# EAGLE schematic Linear Regulator (EAGLE 7.1.0)
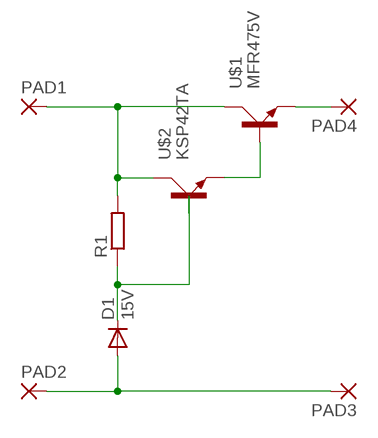
[diagram p0: schematic, sheet 1]

## Parts
D1  15V  DIODE-SOD80C  [SOD80C]
PAD1  2,54/0,9  [2,54/0,9]
PAD2  2,54/0,9  [2,54/0,9]
PAD3  2,54/0,9  [2,54/0,9]
PAD4  2,54/0,9  [2,54/0,9]
R1  R-EU_R1206  [R1206]
U$1  MFR475V  [TO220AV]
U$2  KSP42TA  [SOT-92WIDE]

## Nets
N$1: D1.C R1.1 U$2.B
N$3: PAD1.1(P) R1.2 U$1.C U$2.C
N$4: U$1.B U$2.E
N$5: PAD4.1(P) U$1.E
N$6: D1.A PAD2.1(P) PAD3.1(P)

## Library data of the parts
D1 = diode:DIODE-: DIODE
PAD1-PAD4 = wirepad:2,54/0,9: THROUGH-HOLE PAD
R1 = rcl:R-EU_: RESISTOR, European symbol
U$1 = transistor-power:MFR4*: NPN RF Power Transistor Source: Motorola - MRF475.pdf
U$2 = Namenlos:KSP42TA